# Altium schematic sheet GPS_tracker PWR.SchDoc
size 420 x 297 mm; SheetNumber: 2; SheetTotal: 3; ProjectTitle: Prj name
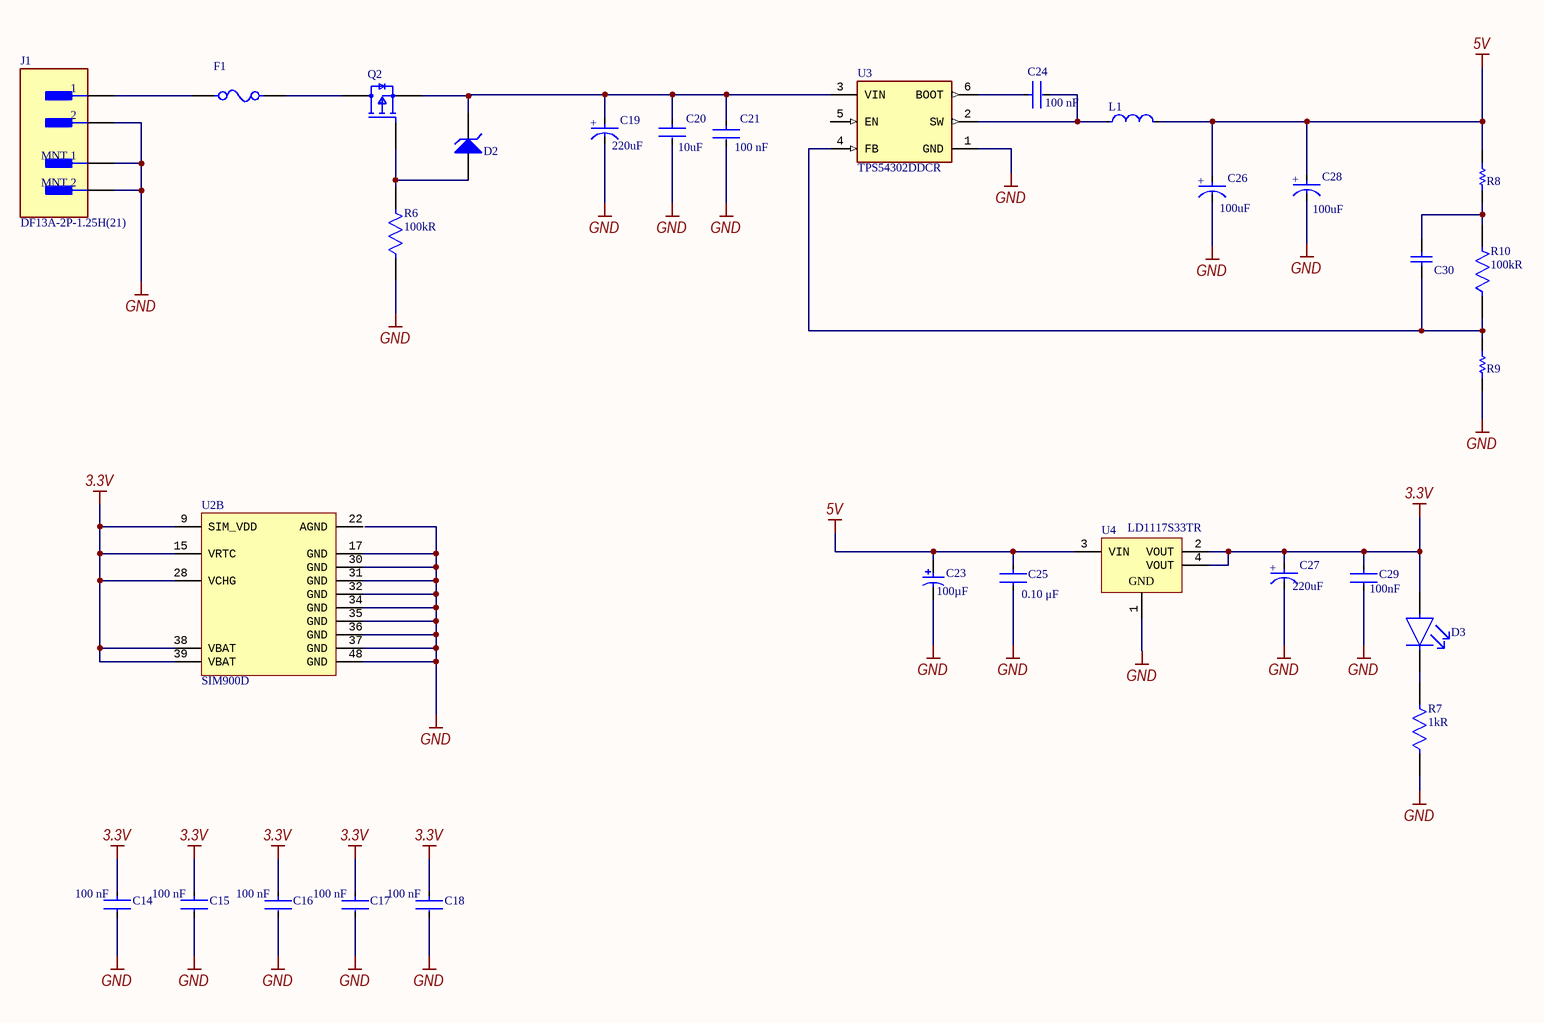
[diagram p0: GPS_tracker PWR.SchDoc]

## Parts
C14  Capacitance: 100 nF  [FP-CC0603-DA-MFG]  (hidden comment: CC0603KRX7R7BB104)
C15  Capacitance: 100 nF  [FP-CC0603-DA-MFG]  (hidden comment: CC0603KRX7R7BB104)
C16  Capacitance: 100 nF  [FP-CC0603-DA-MFG]  (hidden comment: CC0603KRX7R7BB104)
C17  Capacitance: 100 nF  [FP-CC0603-DA-MFG]  (hidden comment: CC0603KRX7R7BB104)
C18  Capacitance: 100 nF  [FP-CC0603-DA-MFG]  (hidden comment: CC0603KRX7R7BB104)
C19  Capacitance: 220uF  [FP-FKF-MFG]  (hidden comment: EEEFK1V221P)
C20  Capacitance: 10uF  [FP-CL32-IPC_C]  (hidden comment: CL32B106KBJNNNE)
C21  Capacitance: 100 nF  [FP-CC0603-DA-MFG]  (hidden comment: CC0603KRX7R7BB104)
C23  Capacitance: 100µF  [PNSC-EEEFK1C101P_L]  (hidden comment: EEEFK1C101P)
C24  Capacitance: 100 nF  [FP-CC0603-DA-MFG]  (hidden comment: CC0603KRX7R7BB104)
C25  value 0.10 μF  [FP-C0805C-DN-MFG]  (hidden comment: C0805C104K5RACTU)
C26  Capacitance: 100uF  [FP-T521D107M025ATE040-MFG]  (hidden comment: T521D107M025ATE040)
C27  Capacitance: 220uF  [FP-TAJC-MFG]  (hidden comment: TAJC227K006RNJ)
C28  Capacitance: 100uF  [FP-T521D107M025ATE040-MFG]  (hidden comment: T521D107M025ATE040)
C29  Capacitance: 100nF  [FP-C0603-CJ-MFG]  (hidden comment: C0603X104K5RACTU)
C30  06035A750JAT2A  [CAPC1608X90X35ML15T15]  (value not drawn)
D2  MMSZ4699T1G  [ONSC-SOD-123-2-425-04_V]  (value not drawn)
D3  SML-D12P8WT86C  [FP-SML-D12-MFG]  (value not drawn)
F1  0452001.MRL  [FP-0452-MFG]  (value not drawn)
J1  DF13A-2P-1.25H(21)  [FP-DF13A-2P-1_25H_21-MFG]
L1  IHLP2525CZER100M11  [FP-IHLP-2525CZ-FP_2_413x3-MFG]  (value not drawn)
Q2  DMP3099L-7  [FP-SOT23-IPC_B]  (value not drawn)
R6  Resistance: 100kR  [FP-RC0603-0_55-MFG]  (hidden comment: RC0603FR-07100KL)
R7  Resistance: 1kR  [FP-CRCW0603-e3-MFG]  (hidden comment: CRCW06031K00FKEA)
R8  RC0603FR-0749R9L  [RESC1608X55X25NL10T15]  (value not drawn)
R9  ERJ-3EKF1332V  [RESC1608X55X30LL15T15]  (value not drawn)
R10  Resistance: 100kR  [FP-RC0603-0_55-MFG]  (hidden comment: RC0603FR-07100KL)
U2  SIM900D  [SIMC-SIM900D_V]  (part B of 2)
U3  TPS54302DDCR  [FP-DDC0006A-MFG]
U4  LD1117S33TR  [SOT-223_L]

## Nets
3.3V: C14.1 C15.1 C16.1 C17.1 C18.1 C27.2(A) C29.1 D3.2(A) U2.9(SIM_VDD) U2.15(VRTC) U2.28(VCHG) U2.38(VBAT) U2.39(VBAT) U4.2(VOUT) U4.4(VOUT)
5V: C23.1 C25.1 C26.2(A) C28.2(A) L1.2 R8.2 U4.3(VIN)
GND: C14.2 C15.2 C16.2 C17.2 C18.2 C19.1(C) C20.2 C21.2 C23.2 C25.2 C26.1(C) C27.1(C) C28.1(C) C29.2 J1.2 J1.3(MNT_1) J1.4(MNT_2) R6.1 R7.1 R9.1 U2.17(GND) U2.30(GND) U2.31(GND) U2.32(GND) U2.34(GND) U2.35(GND) U2.36(GND) U2.37(GND) U2.48(GND) U3.1(GND) U4.1(GND)
NetC19_2: C19.2(A) C20.1 C21.1 D2.1(K) Q2.2(S) U3.3(VIN)
NetC24_1: C24.1 U3.6(BOOT)
NetC24_2: C24.2 L1.1 U3.2(SW)
NetC30_1: C30.1 R9.2 R10.1 U3.4(FB)
NetC30_2: C30.2 R8.1 R10.2
NetD2_2: D2.2(A) Q2.1(G) R6.2
NetD3_1: D3.1(C) R7.2
NetF1_1: F1.1 J1.1
NetF1_2: F1.2 Q2.3(D)

Not connected (* = marked no-connect by the designer): U2 22(AGND); U3 5(EN)

## Notes on the sheet
- Title:
- Author:
- Approved:
- Size:
- Date:
- Git Hash:
- A3
- Prj:
- Sheet
- of
- SW Version:
- Variant:
- Edited:
- CONFIDENTIAL
- File:
- (in symbol CMP-03016-000026-1) +
- (in symbol CMP-04424-000472-1) +
- (in symbol CMP-05427-000085-1) +

## Library data of the parts
C14-C18 C21 C24 = CMP-2000-05002-2: CAP CER 0.1UF 16V X7R 0603; Manufacturer: YAGEO; Tolerance: 0.1; Value: 100 nF; Temperature Coefficient: 15%; Material: Ceramic; Voltage Rating: 16 V; Package: CC0603-DA; ComponentLink2Description: Datasheet; Octopart: https://octopart.com/cc0603krx7r7bb104-yageo-192941; Temperature Range High: +125°C; Digikey Description: CAP CER 0.1UF 16V X7R 0603; Voltage: 16 V; Device Class L2: Capacitors; Height: 0.9mm; Temperature: -55°C to +125°C; Manufacturer Part Number: CC0603KRX7R7BB104; Device Class L1: Passive Components; Device Class L3: Ceramic Capacitors; ComponentLink2URL: http://www.yageo.com/documents/recent/UPY-GPHC_X7R_6.3V-to-50V_18.pdf; Footprint Url: http://www.yageo.com/exep/pages/download/literatures/UPY-C_GEN_24.pdf; RoHS: TRUE; Temperature Range Low: -55°C; Temperature Characteristic: X7R; Lead Free: Yes; Category: Cap; Mouser Description: Multilayer Ceramic Capacitor, CC Series, 0.1 - F, - 10%, X7R, 16 V, 0603 [1608 Metric]; Automotive: No
C19 = CMP-05427-000085-1: CAP ALUM 220UF 20% 35V SMD; Material: Aluminium; Ripple Current (AC): 600mA; Leakage Current: 3uA; Impedance: 160mR; Life (Hours): 2000Hour; Construction: Cylindrical; Voltage Rating: 35V; Voltage: 35V; Size: 10.2mm; Width: 10mm; Height: 10.2mm; Package Quantity: 1; Tolerance: 20%; Dielectric Material: Aluminium; Contact Plating: Tin; Case/Package: Radial; Lead Free: Lead Free; RoHS Compliant: Yes; Height - Seated (Max): 0.402inch; Length: 10.2mm; Radiation Hardening: No; Packaging: Tape and Reel; Mount: Surface Mount; Max Operating Temperature: 105°C; Number of Pins: 2; REACH SVHC: No SVHC; Ripple Current: 600mA; Diameter: 8mm; Termination: SMD/SMT; ESR (Equivalent Series Resistance): 160mR; Voltage Rating (DC): 35V; Min Operating Temperature: -55°C; Series: FK
C20 = CMP-2000-06110-2: Cap Ceramic 10uF 50V X7R ±10% SMD 1210 +125°C Embossed T/R; Material: Ceramic; Min Operating Temperature: -55°C; Depth: 2.5mm; Radiation Hardening: No; Packaging: Tape and Reel; Dielectric: X7R; Case Code (Metric): 3225; Height: 2.5mm; Thickness: 0.106inch; Voltage Rating (DC): 50V; Voltage Rating: 50V; Width: 0.098inch; Case Code (Imperial): 1210; Length: 3.2mm; Tolerance: 10%; Lead Free: Lead Free; Package Quantity: 1; Voltage: 50V; Mount: Surface Mount; Case/Package: 1210; Max Operating Temperature: 125°C
C23 = CMP-2000-06203-1: Aluminum Electrolytic Capacitor, 100 uF, 20%, 16 V, -55 to 105 degC, 2-Pin SMD, RoHS, Tape and Reel; Manufacturer: Panasonic; Lifetime@Temperature: 2000Hrs@105°C; Impedance: 0.36O; Ripple Current: 240mA; Rated Voltage: 16V; Type: Can; Datasheet URL: http://datasheet.octopart.com/EEEFK1C101P-Panasonic-datasheet-13266987.pdf; Package Description: 2-Pin Surface Mount Device, Body 6.6 x 6.6 mm; Manufacturer URL: http://www.panasonic.com/; Case Size/Dimension: Ø6.3x5.8mm; Series: FK; Datasheet Version: 11/2012; Mounting Technology: SurfaceMount; Package Reference: EEEFK1C101P; Operating Temp-Max: 105°C; Operating Temp Range: -55to+105°C
C25 = CMP-2007-00279-2: CAP CER 0.1UF 50V X7R 0805; Manufacturer: KEMET; Tolerance: 0.1; Temperature Coefficient: 30ppm/°C; Material: Ceramic; Manufacturer Part Number: C0805C104K5RACTU; Device Class L2: Capacitors; Temperature Range Low: -55°C; Voltage Rating: 50 V; Digikey Description: CAP CER 0.1UF 50V X7R 0805; Category: Cap; ComponentLink2Description: Datasheet; Octopart: https://octopart.com/c0805c104k5ractu-kemet-143926; RoHS: TRUE; ComponentLink2URL: https://content.kemet.com/datasheets/KEM_C1003_C0G_SMD.pdf; Temperature Characteristic: X7R; Temperature: -55°C to +125°C; Height: 0.88mm; Temperature Range High: +125°C; Device Class L1: Passive Components; Automotive: No; Lead Free: Yes; Ipc Land Pattern Name: CAPC200125X78; Device Class L3: Ceramic Capacitors; Mouser Description: Cap Ceramic 0.1uF 50V X7R 10% SMD 2.0 x 1.2 mm 125 C Paper T/R; Capacitance: 0.10 μF; Package: C0805C-DN
C26 C28 = CMP-03016-000026-1: CAP TANT POLY 100UF 25V 2917; Tolerance: 20%; ESR (Equivalent Series Resistance): 40mR; Min Operating Temperature: -55°C; Voltage Rating: 25V; Width: 0.169inch; Case Code (Imperial): 2917; Packaging: Cut Tape; Max Operating Temperature: 105°C; Length: 0.287inch; Voltage Rating (DC): 25V; Features: General Purpose; REACH SVHC: No SVHC; Height - Seated (Max): 0.122inch; Series: KO-CAP® T521; Case/Package: 2917; Case Code (Metric): 7343; Mount: Surface Mount
C27 = CMP-04424-000472-1: 220uF 6.3V  ±10% 1.2Ω 2312  SMD Tantalum Capacitor; Dissipation Factor: 8%; Leakage Current: 13.9uA; Polarity: Polar; ESR (Equivalent Series Resistance): 1.2R; Radiation Hardening: No; RoHS Compliant: Yes; Depth: 3.2mm; Dielectric Material: Tantalum; Tolerance: 10%; Voltage: 6.3V; REACH SVHC: No SVHC; Packaging: Tape and Reel; Case/Package: 2412; Number of Pins: 2; Package Quantity: 500; Min Operating Temperature: -55°C; Termination: SMD/SMT; Construction: Flat; Features: General Purpose; Series: TAJ; Voltage Rating: 6.3V; Length: 6mm; Max Operating Temperature: 125°C; Height - Seated (Max): 0.11inch; Height: 2.6mm; Lead Free: Lead Free; Voltage Rating (DC): 6.3V; Width: 3.2mm; Case Code (Metric): 6032; Case Code (Imperial): 2312; Mount: Surface Mount
C29 = CMP-2006-03300-2: CAP CER 0.1UF 50V X7R 0603; Manufacturer: Kemet; Material: Ceramic; Tolerance: 10%; Value: 100nF; Temperature Coefficient: 15%; Temperature Range High: +125°C; Temperature Range Low: -55°C; Manufacturer Part Number: C0603X104K5RACTU; Voltage: 50V; ComponentLink2Description: Datasheet; RoHS: TRUE; ComponentLink2URL: https://content.kemet.com/datasheets/KEM_C1013_X7R_FT-CAP_SMD.pdf; Device Class L3: Ceramic Capacitors; Device Class L2: Capacitors; Package: C0603-CJ; Height: 0.95mm; Device Class L1: Passive Components; Temperature Characteristic: X7R; Lead Free: Yes; Digikey Description: CAP CER 0.1UF 50V X7R 0603; Automotive: No; Mouser Description: Capacitor; Ceramic; Cap 0.1uF; Tol+10%; SMT; Flexible Termination; Vol-Rtg 50V; TR; Temperature: -55°C to +125°C; Octopart: https://octopart.com/c0603x104k5ractu-kemet-9145062; Category: Cap; Voltage Rating: 50V; Ipc Land Pattern Name: CAPC16080X80
C30 = CMP-2006-04358-1: Manufacturer: AVX Interconnect / Elco; Part Number: 06035A750JAT2A
D2 = CMP-1060-00478-1: Zener Voltage Regulator, 500 mW, 2-Pin SOD-123, Pb-Free, Tape and Reel; Manufacturer: On Semiconductor; VZ Typ (V): 12; P Max (W): 0.5; ComponentLink2URL: http://www.onsemi.com/pub_link/Collateral/MMSZ4678T1-D.PDF; PartNumber: MMSZ4699T1G; RoHS: Pb-Free; Mounting Technology: Surface Mount; Packing: Tape and Reel; ComponentLink1URL: http://www.onsemi.com/; ComponentLink2Description: Datasheet; ComponentLink3Description: Package Specification; ComponentLink1Description: Manufacturer URL; DatasheetVersion: Rev. 9; ComponentLink3URL: http://www.onsemi.com/pub_link/Collateral/425-04.PDF; PackageVersion: Rev. G, 10/2009; PackageDescription: 2-Pin SOD, Body 1.6 x 2.69 mm; PackageReference: SOD-123-2-425-04
D3 = CMP-08952-000001-1: LED GREEN 1608 SMD; Manufacturer: Rohm; Forward Current: 20mA; Luminous Intensity: 6.3mcd; Wavelength: 560nm; Automotive Grade: Grade 3; Reverse Voltage: 5V; Forward Voltage: 2.2V; Power Dissipation: 54mW; Led Orientation: Top View; Temperature Range Low: -40°C; Automotive: Yes; Height: 0.65mm; Manufacturer Part Number: SML-D12P8WT86C; Device Class L3: unset; Octopart: https://octopart.com/sml-d12p8wt86c-rohm-77740213; Lead Free: Yes; Digikey Description: LED GREEN 1608 SMD; Temperature Range High: +85°C; ComponentLink2URL: https://www.rohm.com/datasheet/SML-D12P8W(C)/sml-d12x8(c)-e; ComponentLink2Description: Datasheet; RoHS: TRUE; Device Class L2: LEDs; Package: SML-D12; Category: Diode; Temperature: -40°C to +85°C; Mouser Description: LED Uni-Color Green Automotive 2-Pin Chip 0603(1608Metric) T/R; Colour: Green; Device Class L1: Optoelectronics
F1 = CMP-08605-000042-1: FUSE BRD MNT 1A 125VAC/VDC 2SMD; Manufacturer: Littelfuse Inc; Fuse I2T: 1.98A2Sec; Max Fuse Ac Voltage: 125V; Resistance: 0.225Ω; Fuse Interrupt Ac Current: 50A; Fuse Interrupt Dc Current: 300A; Value: 0.225Ω; Fuse Blow Speed: Slow; Temperature: -55°C to +125°C; Temperature Range High: +125°C; Package: 0452; ComponentLink2URL: https://www.littelfuse.com/~/media/electronics/datasheets/fuses/littelfuse_fuse_452_454_datasheet.pdf.pdf; Max Fuse Dc Voltage: 125V; Temperature Range Low: -55°C; Device Class L2: Fuses; Mouser Description: Surface Mount Fuses 125V 1A; Device Class L3: unset; ComponentLink2Description: Datasheet; Device Class L1: Circuit Protection; Fuse Current: 1A; Automotive: No; Digikey Description: FUSE BRD MNT 1A 125VAC/VDC 2SMD; Height: 2.94mm; Category: Fuse; Octopart: https://octopart.com/0452001.mrl-littelfuse-566112; Manufacturer Part Number: 0452001.MRL; Voltage Rating: 125V; Lead Free: Yes; RoHS: TRUE
J1 = CMP-11610-000001-1: CONN HEADER SMD R/A 2POS 1.25MM; Manufacturer: Hirose; Voltage Rating: 150V; Current Rating: 1A; Conn Gender: Male; Number Of Contacts: 2; Conn Orientation: Right Angle; Digikey Description: CONN HEADER SMD R/A 2POS 1.25MM; ComponentLink2Description: Datasheet; Automotive: No; Temperature: -35°C to +85°C; RoHS: TRUE; Category: Conn; Contact Material: Tin; Device Class L2: Headers and Wire Housings; Temperature Range Low: -35°C; Number Of Rows: 1; Device Class L3: unset; ComponentLink2URL: https://www.hirose.com/product/download/?distributor=digikey&type=2d&lang=en&num=DF13A-2P-1.25H(21); Pitch: 1.25mm; Package: 0; Manufacturer Part Number: DF13A-2P-1.25H(21); Lead Free: Yes; Temperature Range High: +85°C; Height: 3.75mm; Device Class L1: Connectors; Octopart: https://octopart.com/df13a-2p-1.25h%2821%29-hirose-24789905; Mouser Description: Headers & Wire Housings 2P SNG ROW PIN HDR R/A SMT
L1 = CMP-02424-000281-1: Commercial Inductors, Low DCR Series 10uH 4A 71.2mΩ 20%; Self Resonant Frequency: 5MHz; Shielding: Shielded; Saturation Current: 3.5A; Max DC Current: 3A; Test Frequency: 100kHz; Core Material: Ferrite; DC Resistance (DCR): 71.2mR; Mount: Surface Mount; Military Standard: Not; Tolerance: 20%; Contact Plating: Tin; Package Quantity: 2000; Packaging: Tape and Reel; Current Rating: 4A; Lead Free: Lead Free; Depth: 6.72mm; Height - Seated (Max): 0.118inch; Max Operating Temperature: 125°C; Termination: SMD/SMT; Inductance: 10uH; RMS Current (Irms): 4A; Case Code (Metric): 6363; Length: 7.24mm; Number of Pins: 2; Inductance Tolerance: 20%; Height: 3mm; Width: 0.255inch; Radiation Hardening: No; Case Code (Imperial): 2525; Case/Package: 2525; Min Operating Temperature: -55°C
Q2 = CMP-12801-000062-2: MOSFET P-CH 30V SOT23; Gate to Source Voltage (Vgs): 20V; Turn-Off Delay Time: 31ns; Drain to Source Voltage (Vdss): -30V; Fall Time: 15ns; Threshold Voltage: -2.1V; Rise Time: 5ns; Input Capacitance: 563pF; Number of Channels: 1; Drain to Source Resistance: 65mR; Element Configuration: Single; Max Power Dissipation: 1.08W; Turn-On Delay Time: 4.8ns; Continuous Drain Current (ID): 3.8A; Lead Free: Lead Free; Number of Pins: 3; Package Quantity: 3000; Width: 1.4mm; Radiation Hardening: No; Mount: Surface Mount; Case/Package: SOT-23; Contact Plating: Tin; Rds On Max: 65mR; Height: 1.1mm; REACH SVHC: No SVHC; Weight: 0.000282oz; Max Operating Temperature: 150°C; Packaging: Tape and Reel; Min Operating Temperature: -55°C; Length: 3mm
R6 R10 = CMP-2100-03662-2: RES SMD 100K OHM 1% 1/10W 0603; Voltage Rating (DC): 50V; Max Power Dissipation: 100mW; Temperature Coefficient: 100ppm/°C; Working Voltage: 75V; Length: 1.6mm; Lead Free: Lead Free; Number of Terminations: 2; Packaging: Tape and Reel; Voltage Rating: 50V; Termination: SMD/SMT; Width: 0.8mm; Resistor Type: Thick Film; Resistance Tolerance: 1%; Features: Moisture Resistant; Height: 0.45mm; Construction: Rectangular; Case/Package: 0603; Military Standard: Not; Case Code (Imperial): 0603; Series: RC; Technology: THICK FILM; Depth: 0.8mm; RoHS Compliant: Yes; REACH SVHC: No SVHC; Min Operating Temperature: -55°C; Case Code (Metric): 1608; Max Operating Temperature: 155°C; Power Rating: 100mW; Number of Pins: 2; Tolerance: 1%
R7 = CMP-1666-00003-5: RES Thick Film, 1kΩ, 1%, 0.1W, 100ppm/°C, 0603; Max Power Dissipation: 100mW; Voltage Rating: 75V; Max Operating Temperature: 155°C; Number of Pins: 2; Case Code (Imperial): 0603; Width: 0.033inch; Power Rating: 100mW; Number of Terminations: 2; Package Quantity: 10; Weight: 7.1E-05oz; Tolerance: 1%; Temperature Coefficient: 100ppm/°C; Military Standard: Not; Mount: Surface Mount; Voltage Rating (DC): 75V; Depth: 0.85mm; Composition: Thick Film; Radiation Hardening: No; Termination: SMD/SMT; Length: 1.55mm; Case Code (Metric): 1608; Contact Plating: Tin; Min Operating Temperature: -55°C; Packaging: Tape and Reel; Height: 0.45mm; Lead Free: Lead Free; Case/Package: 0603; Features: Automotive AEC-Q200
R8 = CMP-1659-00036-1: General Purpose Chip Resistor, 49.9 Ohm, +/- 1%, -55 to 155 degC, 0603 (1608 Metric), RoHS, Tape and Reel; Max Supply Voltage: 3.63 V; Case\Package: LQFP; Interface: SPI; Min Supply Voltage: 2.97 V; PackageReference: 0603; Packaging: Tray; ComponentLink2Description: Datasheet; ComponentLink1Description: Manufacturer URL; ComponentLink2URL: https://datasheet.ciiva.com/11808/0900766b80f96399-11808223.pdf; RoHSCompliant: true; Max Operating Temperature: 85 degC; ComponentLink1URL: http://www.yageo.com/; PackageDescription: 2-Pin Surface Mount Device, Body 1.6 x 0.8 mm; DatasheetVersion: Rev. 4, 04/2009; Min Operating Temperature: -40 degC; Package Quantity: 250; Pins: 48
R9 = CMP-2000-00238-1: Manufacturer: Panasonic; Part Number: ERJ-3EKF1332V
U2 = CMP-2000-07069-1: Quad-Band GSM/GPRS Module, 850/900/1800/1900 MHz, 3.2 to 4.8 V, -40 to 85 degC, 48-Pin SMD, RoHS, Tape and Reel; Manufacturer: SIM Com; Datasheet Version: Rev. 2.02, 05/2012; Datasheet URL: http://mt-system.ru/sites/default/files/documents/sim900d_hardware_design_v2.02_0.pdf; Mounting Technology: SurfaceMount; Package Description: 48-Pin Surface Mount Device, Body 33 x 33 mm, Pitch 1.5 mm; Package Reference: SIM900D; Manufacturer URL: http://simcomm2m.com/
U3 = CMP-04918-000032-1: IC REG BUCK ADJ 3A TSOT23-6; Manufacturer: Texas Instruments; Output Voltage: 0.6-26V; Output Type: AdjustableProgrammable; Max Junction Temp: +125°C; Number Of Outputs: 1; Min Supply Voltage: 4.5V; Switching Frequency: 400kHz; Standoff Height: 0mm; Max Duty Cycle: 100%; Nominal Supply Current: 45uA; Max Supply Voltage: 28V; Temperature Range High: +125°C; Switching Topology: Buck; Device Class L2: Power Management ICs; Output Current: 3A; Automotive: No; Temperature Range Low: -40°C; Temperature: -40°C to +125°C; Height: 1.1mm; Ipc Land Pattern Name: SOT95P280X110-6; RoHS: TRUE; Digikey Description: IC REG BUCK ADJ 3A TSOT23-6; Manufacturer Part Number: TPS54302DDCR; ComponentLink2Description: Datasheet; Device Class L3: Voltage Regulators - Switching; Octopart: https://octopart.com/tps54302ddcr-texas+instruments-74209025; Device Class L1: Integrated Circuits (ICs); Lead Free: Yes; ComponentLink2URL: http://www.ti.com/lit/ds/symlink/tps54302.pdf; Category: IC; Package: DDC0006A
U4 = CMP-0244-00310-1: Fixed Low Drop Positive Voltage Regulator, 3.3V, 4-Pin SOT-223, Tape and Reel; ComponentLink2Description: Datasheet; PackageDescription: 4-Pin SOT-223 Package, 6.5 x 3.5 mm Body, 2.3 mm Pitch, 7 mm Lead Span; PackageVersion: 2010; ComponentLink2URL: http://www.st.com/internet/com/TECHNICAL_RESOURCES/TECHNICAL_LITERATURE/DATASHEET/CD00000544.pdf; PackageReference: SOT-223; DatasheetVersion: 1/11/2011; ComponentLink1Description: Manufacturer URL; ComponentLink1URL: http://www.st.com